# EAGLE design aprs_tracker_v3 (EAGLE 9.6.2)
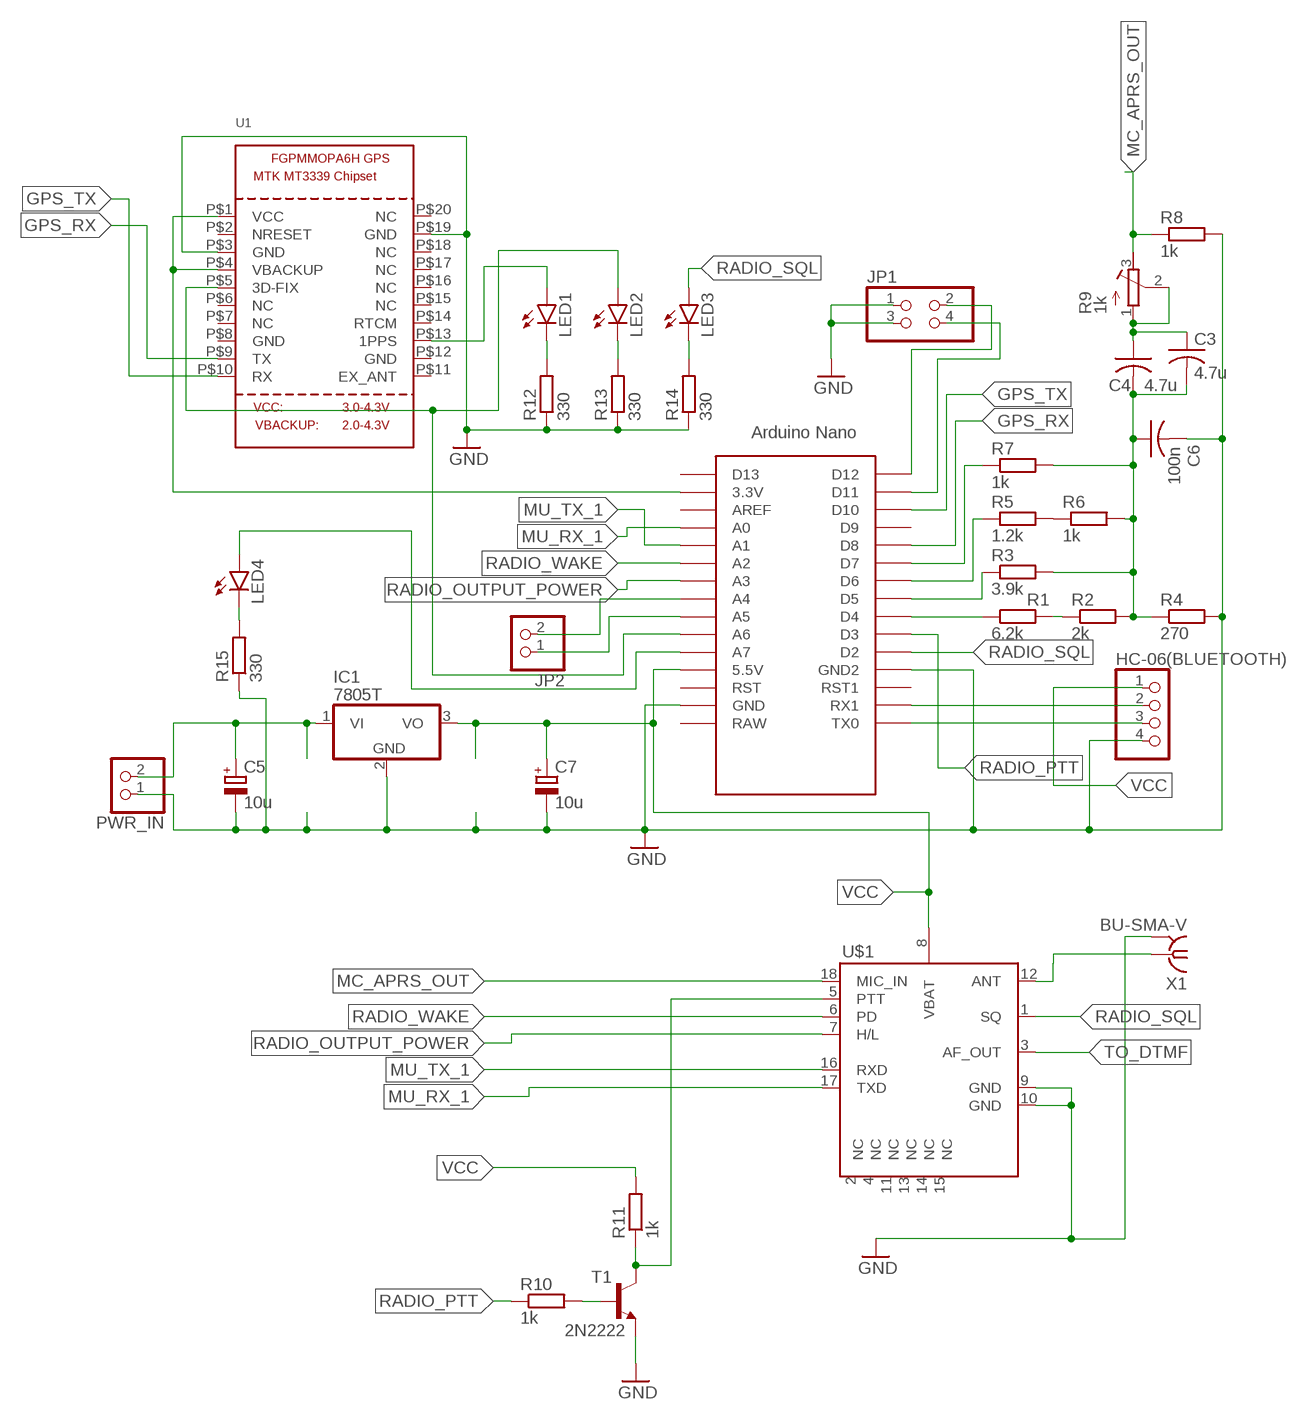
[diagram p0: schematic, sheet 1]

## Parts
C3  4.7u  C-US050-024X044  [C050-024X044]
C4  4.7u  C-USC1206  [C1206]
C5  10u  CPOL-EUE5-6  [E5-6]
C6  100n  C-US050-024X044  [C050-024X044]
C7  10u  CPOL-EUE5-6  [E5-6]
HC-06(BLUETOOTH)  PINHD-1X4  [1X04]
IC1  7805T  [TO220H]
JP1  PINHD-2X2  [2X02]
JP2  PINHD-1X2  [1X02]
LED1  LEDCHIP-LED0805  [CHIP-LED0805]
LED2  LEDCHIP-LED0805  [CHIP-LED0805]
LED3  LEDCHIP-LED0805  [CHIP-LED0805]
LED4  LEDCHIP-LED0805  [CHIP-LED0805]
PWR_IN  PINHD-1X2  [1X02]
R1  6.2k  R-EU_0207/7  [0207/7]
R2  2k  R-EU_0207/7  [0207/7]
R3  3.9k  R-EU_0207/7  [0207/7]
R4  270  R-EU_0204/7  [0204/7]
R5  1.2k  R-EU_0207/7  [0207/7]
R6  1k  R-EU_0207/7  [0207/7]
R7  1k  R-EU_0207/7  [0207/7]
R8  1k  R-EU_0207/7  [0207/7]
R9  1k  R-TRIMM3339P  [RTRIM3339P]
R10  1k  R-EU_0207/7  [0207/7]
R11  1k  R-EU_0207/7  [0207/7]
R12  330  R-EU_R0805  [R0805]
R13  330  R-EU_R0805  [R0805]
R14  330  R-EU_R0805  [R0805]
R15  330  R-EU_R0805  [R0805]
T1  2N2222  [TO92-EBC-OVAL]
U1  GPS_FGPMMOPA6H  [FGPMMOPA6H]
U$1  DRA818A  [DRA818A]
U$4  NANO-2  [NANO-NOICSP]
X1  BU-SMA-V  [BU-SMA-V]

## Nets
GND [V_bat]: C5.- C6.2 C7.- HC-06(BLUETOOTH).4 IC1.2(GND) JP1.1 JP1.3 PWR_IN.1 R4.2 R8.2 R12.1 R13.1 R14.1 R15.1 T1.E U1.P$3(GND) U1.P$19(GND) U$1.9(GND) U$1.10(GND) U$4.GND U$4.GND1(GND2) X1.2 X1.3 X1.4 X1.5
GPS_RX: U1.P$9(TX) U$4.D8
GPS_TX: U1.P$10(RX) U$4.D10
MC_APRS_OUT: R8.1 R9.3(E) U$1.18(MIC_IN)
MU_RX_1: U$1.17(TXD) U$4.A0
MU_TX_1: U$1.16(RXD) U$4.A1
N$1 [50 ohm]: U$1.12(ANT) X1.1
N$2: C5.+ IC1.1(VI) PWR_IN.2
N$3: HC-06(BLUETOOTH).2 U$4.RX1
N$4: R1.1 U$4.D4
N$5: R3.1 U$4.D5
N$6: R5.1 U$4.D6
N$7: R7.1 U$4.D7
N$8: R1.2 R2.1
N$9: R5.2 R6.1
N$10: C3.2 C4.2 C6.1 R2.2 R3.2 R4.1 R6.2 R7.2
N$11: C3.1 C4.1 R9.1(A) R9.2(S)
N$12: R11.1 T1.C U$1.5(PTT)
N$13: HC-06(BLUETOOTH).3 U$4.TX0
N$14: R10.2 T1.B
N$15: JP1.2 U$4.D12
N$16: JP1.4 U$4.D11
N$17: JP2.1 U$4.A5
N$18: JP2.2 U$4.A4
N$19: U1.P$1(VCC) U1.P$4(VBACKUP) U$4.3.3V
N$20: LED1.C R12.2
N$21: LED2.C R13.2
N$22: LED3.C R14.2
N$23: LED1.A U1.P$13(1PPS)
N$24: LED4.C R15.2
N$25: LED4.A U$4.A7
N$26: LED2.A U1.P$5(3D-FIX) U$4.A6
RADIO_OUTPUT_POWER: U$1.7(H/L) U$4.A3
RADIO_PTT: R10.1 U$4.D3
RADIO_SQL: LED3.A U$1.1(SQ) U$4.D2
RADIO_WAKE: U$1.6(PD) U$4.A2
TO_DTMF: U$1.3(AF_OUT)
VCC: C7.+ HC-06(BLUETOOTH).1 IC1.3(VO) R11.2 U$1.8(VBAT) U$4.5V(5.5V)
Unconnected: U1.P$2(NRESET) U1.P$6(NC) U1.P$7(NC) U1.P$8(GND) U1.P$11(EX_ANT) U1.P$12(GND) U1.P$14(RTCM) U1.P$15(NC) U1.P$16(NC) U1.P$17(NC) U1.P$18(NC) U1.P$20(NC) U$1.2(NC) U$1.4(NC) U$1.11(NC) U$1.13(NC) U$1.14(NC) U$1.15(NC) U$4.AREF U$4.D9 U$4.D13 U$4.P$1(ICSP1) U$4.P$2(ICSP2) U$4.P$3(ICSP3) U$4.P$4(ICSP4) U$4.P$5(ICSP5) U$4.P$6(ICSP6) U$4.RAW U$4.RST U$4.RST1

## Library data of the parts
C3 C4 C6 = rcl:C-US: CAPACITOR, American symbol; SPICEPREFIX: C
C5 C7 = rcl:CPOL-EU: POLARIZED CAPACITOR, European symbol; SPICEPREFIX: C
HC-06(BLUETOOTH) = pinhead:PINHD-1X4: PIN HEADER
IC1 = adafruit:78*: Positive VOLTAGE REGULATOR Added bigger pads to the TO-92 package
JP1 = pinhead:PINHD-2X2: PIN HEADER
JP2 PWR_IN = pinhead:PINHD-1X2: PIN HEADER
LED1-LED4 = led:LED: LED OSRAM: - CHIPLED LG R971, LG N971, LY N971, LG Q971, LY Q971, LO R971, LY R971 LH N974, LH R974 LS Q976, LO Q976, LY Q976 LO Q996 - Hyper CHIPLED LW Q18S LB Q993, LB Q99A, LB R99A - SideLED LS A670, LO A670, LY A670, LG A670, LP A670 LB A673, LV A673, LT A673, LW A673 LH A674 LY A675 LS A676, LA A676, LO A676, LY A676, LW A676 LS A679, LY A679, LG A679 - Hyper Micro SIDELED® LS Y876, LA Y876, LO Y876, LY Y876 LT Y87S - SmartLED LW L88C, LW L88S LB L89C, LB L89S, LG L890 LS L89K, LO L89K, LY L89K LS L896, LA L896, LO L896, LY L896 - TOPLED LS T670, LO T670, LY T670, LG T670, LP T670 LSG T670, LSP T670, LSY T670, LOP T670, LYG T670 LG T671, LOG T671, LSG T671 LB T673, LV T673, LT T673, LW T673 LH T674 LS T676, LA T676, LO T676, LY T676, LB T676, LH T676, LSB T676, LW T676 LB T67C, LV T67C, LT T67C, LS T67K, LO T67K, LY T67K, LW E67C LS E67B, LA E67B, LO E67B, LY E67B, LB E67C, LV E67C, LT E67C LW T67C LS T679, LY T679, LG T679 LS T770, LO T770, LY T770, LG T770, LP T770 LB T773, LV T773, LT T773, LW T773 LH T774 LS E675, LA E675, LY E675, LS T675 LS T776, LA T776, LO T776, LY T776, LB T776 LHGB T686 LT T68C, LB T68C - Hyper Mini TOPLED® LB M676 - Mini TOPLED Santana® LG M470 LS M47K, LO M47K, LY M47K Source: http://www.osram.convergy.de LUXEON: - LUMILED® LXK2-PW12-R00, LXK2-PW12-S00, LXK2-PW14-U00, LXK2-PW14-V00 LXK2-PM12-R00, LXK2-PM12-S00, LXK2-PM14-U00 LXK2-PE12-Q00, LXK2-PE12-R00, LXK2-PE12-S00, LXK2-PE14-T00, LXK2-PE14-U00 LXK2-PB12-K00, LXK2-PB12-L00, LXK2-PB12-M00, LXK2-PB14-N00, LXK2-PB14-P00, LXK2-PB14-Q00 LXK2-PR12-L00, LXK2-PR12-M00, LXK2-PR14-Q00, LXK2-PR14-R00 LXK2-PD12-Q00, LXK2-PD12-R00, LXK2-PD12-S00 LXK2-PH12-R00, LXK2-PH12-S00 LXK2-PL12-P00, LXK2-PL12-Q00, LXK2-PL12-R00 Source: www.luxeon.com KINGBRIGHT: KA-3528ASYC Source: www.kingbright.com
R1-R8 R10-R15 = rcl:R-EU_: RESISTOR, European symbol; SPICEPREFIX: R
R9 = rcl:R-TRIMM: Trimm resistor; SPICEMODEL: X; SPICEPREFIXL: POT
T1 = adafruit:2N2222: NPN TRANSISTOR Big oval pads
U1 = adafruit:GPS_FGPMMOPA6H: GPS Module - MTK MT3339 Chipset, -165dBm sensitivity, 22 channels, 10Hz, auto-select external antenna options
U$1 = dorji:DRA818A
U$4 = Arduino-clone:NANO-2
X1 = con-coax:BU-SMA-V: FEMALE SMA CONNECTOR Radiall distributor RS 112-3794; OC_FARNELL: unknown; OC_NEWARK: unknown

## Net classes
0 default: width 0.356 mm, clearance 0.381 mm
1 PWR: width 0.254 mm, clearance 0.305 mm
2 V_bat: width 0.305 mm, clearance 0.152 mm
3 50 ohm: width 1.21 mm, clearance 0.26 mm

## Board
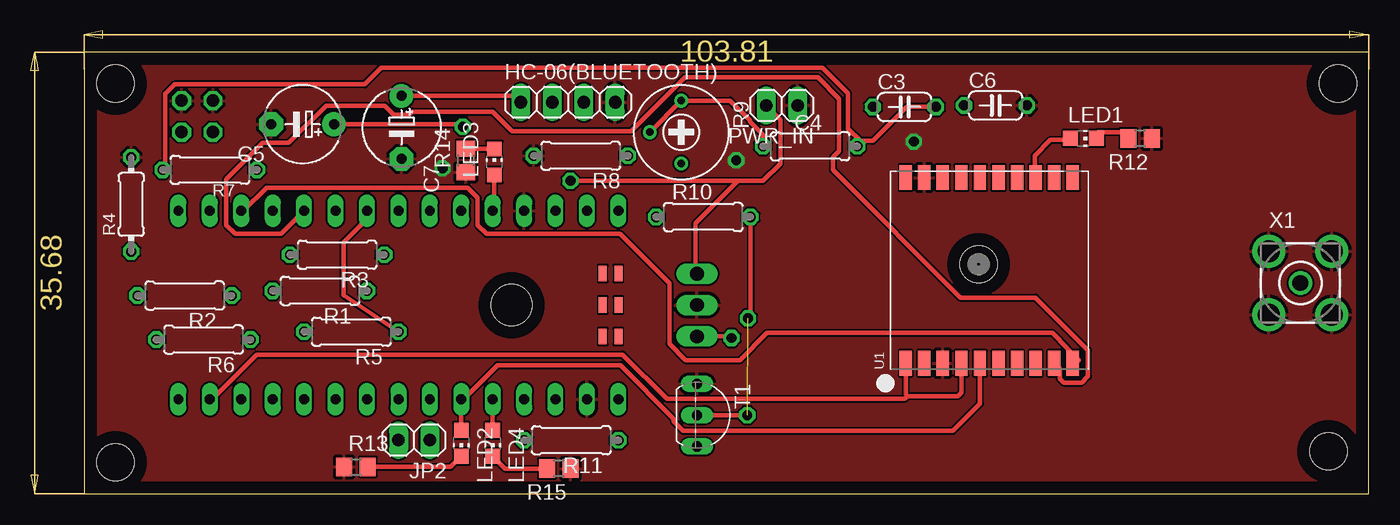
[diagram p1: board, top side]
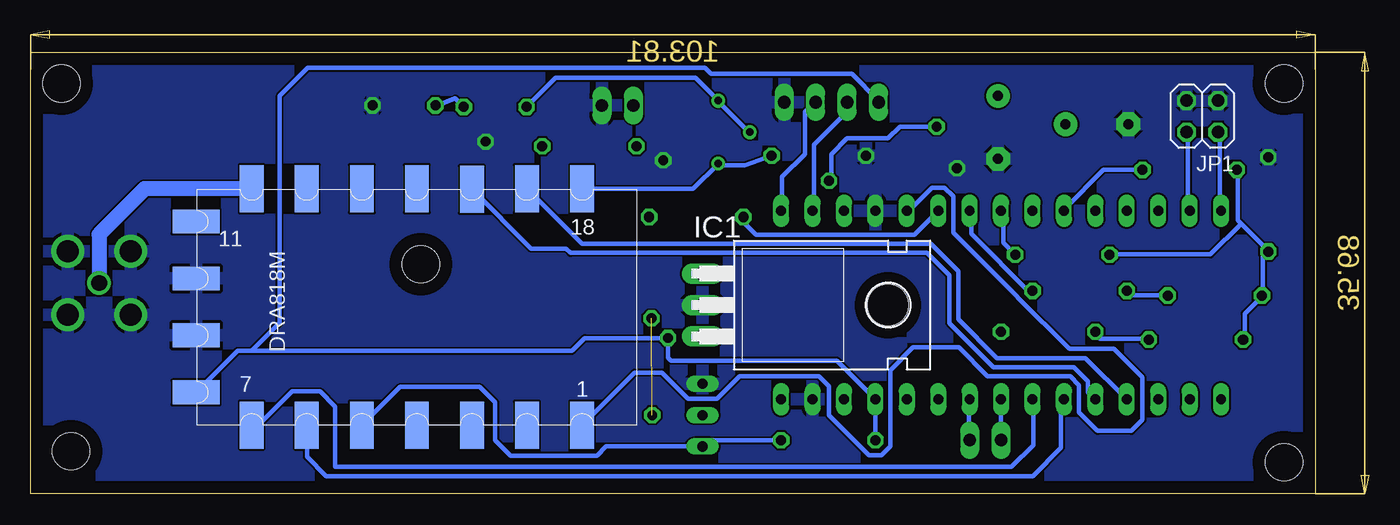
[diagram p2: board, bottom side, seen from below]

Size 103.81 x 35.68 mm. Coordinates in mm from the lower left corner, seen from the top.
Outline: 0,0 103.81,0 103.81,35.68 0,35.68 0,0
Copper layers (1*16): Top 0.035mm / dielectric 1.5mm / Bottom 0.035mm
Design rules "default": minimum track width 6mil, minimum drill 0.35mm, track to track 6mil, track to pad 6mil, pad to pad 6mil, via to via 6mil, smd to smd 6mil, copper to edge 40mil, drill to drill 6mil, minimum pad ring 10mil, minimum via ring 8mil, stop-mask expansion 4mil, vias tented up to drill 0mil, thermal gap 10mil
Holes 3 mm at 2.54,33.15 2.54,2.54 101.35,33.15 100.58,3.43

### Footprints (pad centres in the part's own frame; a part is rotated, then mirrored left to right if it is on the bottom)
C050-024X044 = drill 0.813 octagon: 1 -2.54,0; 2 2.54,0
0207/7 = drill 0.813 octagon: 1 -3.81,0; 2 3.81,0
E5-6 = drill 0.813 pad 1.905: + -2.54,0 | drill 0.813 pad 1.905 octagon: - 2.54,0
1X04 = drill 1.016 long: 1 -3.81,0; 2 -1.27,0; 3 1.27,0; 4 3.81,0
TO220H = drill 1.118 long: 1 -2.54,-10.16; 2 0,-10.16; 3 2.54,-10.16 | hole 3.302: 0,4.826
2X02 = drill 1.016 octagon: 1 -1.27,-1.27; 2 -1.27,1.27; 3 1.27,-1.27; 4 1.27,1.27
1X02 = drill 1.016 long: 1 -1.27,0; 2 1.27,0
CHIP-LED0805 = smd 1.2 x 1.2: A 0,-1.05; C 0,1.05
0204/7 = drill 0.813 octagon: 1 -3.81,0; 2 3.81,0
RTRIM3339P = drill 0.61: 1 -2.54,0; 2 0,-2.54; 3 2.54,0
R0805 = smd 1.3 x 1.5: 1 -0.95,0; 2 0.95,0
TO92-EBC-OVAL = drill 0.813 long: B 0,-1.27; C 2.54,-1.27; E -2.54,-1.27
FGPMMOPA6H = smd 2 x 1: P$1 -7.5,6.75; P$2 -7.5,5.25; P$3 -7.5,3.75; P$4 -7.5,2.25; P$5 -7.5,0.75; P$6 -7.5,-0.75; P$7 -7.5,-2.25; P$8 -7.5,-3.75; P$9 -7.5,-5.25; P$10 -7.5,-6.75; P$11 7.5,-6.75; P$12 7.5,-5.25; P$13 7.5,-3.75; P$14 7.5,-2.25; P$15 7.5,-0.75; P$16 7.5,0.75; P$17 7.5,2.25; P$18 7.5,3.75; P$19 7.5,5.25; P$20 7.5,6.75 | hole 3: 0.5,0.85
DRA818A = smd 3.81 x 1.93: 1 -9.45,-13.25; 2 -9.45,-8.8; 3 -9.45,-4.35; 4 -9.45,0.1; 5 -9.45,4.55; 6 -9.45,9; 7 -9.45,13.45; 12 9.65,13.45; 13 9.65,9; 14 9.65,4.55; 15 9.65,0.1; 16 9.6,-4.35; 17 9.65,-8.8; 18 9.65,-13.25 | smd 1.93 x 3.81: 8 -6.8,17.95; 9 -2.2,17.95; 10 2.4,17.95; 11 7,17.95
NANO-NOICSP = drill 0.8 long: 3.3V -10.16,24.13; 5V -10.16,-1.27; A0 -10.16,19.05; A1 -10.16,16.51; A2 -10.16,13.97; A3 -10.16,11.43; A4 -10.16,8.89; A5 -10.16,6.35; A6 -10.16,3.81; A7 -10.16,1.27; AREF -10.16,21.59; D2 5.08,1.27; D3 5.08,3.81; D4 5.08,6.35; D5 5.08,8.89; D6 5.08,11.43; D7 5.08,13.97; D8 5.08,16.51; D9 5.08,19.05; D10 5.08,21.59; D11 5.08,24.13; D12 5.08,26.67; D13 -10.16,26.67; GND -10.16,-6.35; GND1 5.08,-1.27; RAW -10.16,-8.89; RST -10.16,-3.81; RST1 5.08,-3.81; RX1 5.08,-6.35; TX0 5.08,-8.89 | smd 1.27 x 0.635: P$1 -5.08,-8.89; P$2 -5.08,-7.62; P$3 -2.54,-7.62; P$4 0,-7.62; P$5 -2.54,-8.89; P$6 0,-8.89
BU-SMA-V = drill 1.27: 1 0,0 | drill 1.778: 2 -2.55,2.55; 3 2.55,2.55; 4 2.55,-2.55; 5 -2.55,-2.55

### Placement (x,y rotation side)
C3  66.29,31.24 0 top
C4  4.7u  [0207/7]  58.67,28.07 0 top
C5  [E5-6]  17.65,29.84 180 top
C6  73.66,31.37 0 top
C7  [E5-6]  25.65,29.59 270 top
HC-06(BLUETOOTH)  39.12,31.62 0 top
IC1  39.37,15.24 270 bottom
JP1  9.14,30.48 180 bottom
JP2  26.67,4.32 180 top
LED1  80.77,28.7 270 top
LED2  30.48,4.06 180 top
LED3  33.15,26.8 0 top
LED4  33.02,4.06 180 top
PWR_IN  56.39,31.37 180 top
R1  19.05,16.38 180 top
R2  8.13,16 180 top
R3  20.45,19.3 180 top
R4  3.81,23.37 90 top
R5  21.59,13.08 180 top
R6  9.65,12.45 180 top
R7  10.16,26.16 180 top
R8  40.13,27.3 180 top
R9  48.26,29.21 270 top
R10  50.04,22.35 0 top
R11  39.37,4.32 180 top
R12  85.34,28.7 180 top
R13  21.97,2.16 0 top
R14  30.86,26.92 90 top
R15  38.35,2.03 180 top
T1  50.8,6.35 270 top
U1  73.15,18.03 90 top
U$1  72.52,14.99 90 bottom
U$4  34.29,17.78 90 top
X1  98.3,17.02 0 top

### Tracks (layer width: path | path; a pad name or v marks a point on that pad's centre or on a via)
GND  (via drill 0.8 pad 1.3)
  other vias: 28.96,26.29 67.06,28.45 52.7,26.92
  pour Top: -1.78,35.05 -1.78,-1.27 106.17,-1.27 106.17,35.05
  pour Bottom: -5.08,38.35 105.16,38.35 105.16,-1.27 -5.08,-1.27
GPS_RX
  Top 0.356: U1.P$9 78.84,10.09 78.84,9.3 79.17,8.97 80.63,8.97 81.13,9.47 81.13,11.6 76.89,15.84 70.83,15.84 60.5,26.16 60.5,27.18 61.01,27.68 61.01,31.92 59.3,33.63 48.56,33.63 44.22,29.29 34.59,29.29 34.1,29.78 33.02,30.86 26.52,30.86 26.28,30.62 25.03,30.62 24.29,31.36 19.57,31.36 16.54,28.33 14.42,28.33 11.49,25.4 11.49,21.7 12.2,20.99 15.91,20.99 U$4.D8
GPS_TX
  Top 0.356: U$4.D10 12.87,22.86 14.74,24.73 30.98,24.73 31.81,23.9 31.81,21.7 32.52,20.99 43.32,20.99 47.3,17.02 47.3,12.12 48.62,10.79 53.02,10.79 55.2,12.98 78.24,12.98 79.46,11.77 79.46,11.72 80.39,10.79 79.69,10.1 79.69,10.32 U1.P$10
MC_APRS_OUT
  Bottom 0.356: U$1.18 50.29,24.64 R9.3 48.25,26.52 46.11,26.52 R8.1
MU_RX_1
  Bottom 0.356: U$1.17 59.27,20.19 31.75,20.19 31.09,20.19 28.85,17.96 28.85,14.09 25.73,10.96 18.58,10.96 U$4.A0
MU_TX_1
  Bottom 0.356: U$1.16 63.38,19.8 60.56,19.8 60.21,19.46 31.39,19.46 29.59,17.65 29.59,13.78 26.04,10.22 19.51,10.22 18.37,9.08 18.37,8.21 U$4.A1
N$1
  Bottom 1.21: U$1.12 94.62,24.64 98.3,20.95 X1.1
N$2  (via drill 0.8 pad 1.3)
  Top 0.356: IC1.1 49.4,17.91 49.4,21.84 52.83,25.27 | 52.83,25.27 54.86,25.27 56.26,26.67 56.26,30.23 PWR_IN.2 | C5.+ 30.61,29.84 v30.61,29.65 | v39.3,25.27 52.83,25.27
  Bottom 0.356: v30.61,29.65 33.59,29.65 34.54,28.7 37.85,28.7 39.12,27.43 39.12,25.27 v39.3,25.27
N$3
  Bottom 0.356: U$4.RX1 40.51,23.02 40.51,28.19 37.85,30.86 HC-06(BLUETOOTH).2
N$4
  Bottom 0.356: U$4.D4 27.81,22.84 27.81,20.99 23.02,16.2 R1.1
N$5
  Bottom 0.356: U$4.D5 25.23,22.84 25.23,20.26 24.31,19.34 R3.1
N$6
  Top 0.356: U$4.D6 22.86,22.23 20.95,20.32 20.95,16.04 R5.1
N$7
  Bottom 0.356: U$4.D7 20.26,23.02 17.13,26.15 13.99,26.15 R7.1
N$8
  Bottom 0.356: R2.1 11.97,16.02 14.92,16.02 15.1,16.2 R1.2
N$9
  Bottom 0.356: R6.1 13.63,12.52 17.41,12.52 R5.2
N$10
  Top 0.356: 62.74,28.5 63.75,28.5 66.49,31.24 C3.2 | R7.2 6.55,26.36 6.55,32.3 7.33,33.07 22.68,33.07 24.01,34.4 59.69,34.4 61.75,32.35 61.75,29.49 62.74,28.5 | C4.2 62.74,28.32 62.74,28.5
  Bottom 0.356: C3.2 69.53,31.94 71.12,31.31 C6.1 | R6.2 5.71,12.52 5.71,14.55 4.42,15.84 R2.2 4.24,16.02 4.24,19.15 3.87,19.52 R4.1 3.87,19.7 5.99,21.82 | 5.99,21.82 6.26,22.1 6.26,26.15 R7.2 | 5.99,21.82 8.47,19.34 16.57,19.34 R3.2
N$11
  Top 0.356: R9.2 R9.1 52.2,31.75 53.8,30.15 53.8,30.06 54.86,28.99 C4.1
  Bottom 0.356: R9.2 45.85,29.28 48.25,31.67 R9.1 50.1,33.59 61.4,33.59 C3.1
N$12
  Bottom 0.356: R11.1 49.02,4.32 T1.C 57.33,3.81 58.07,3.07 65.05,3.07 66.29,4.32 66.29,7.37 67.56,8.64 73.97,8.64 U$1.5
N$13
  Bottom 0.356: HC-06(BLUETOOTH).3 40.48,31.62 41.25,30.85 41.25,27.44 43.09,25.6 43.09,23.02 U$4.TX0
N$14  (via drill 0.8 pad 1.3)  (1 unrouted)
  Top 0.356: R10.2 53.85,14.16 v53.66,14.16 | T1.B v53.59,6.35
N$15
  Bottom 0.356: U$4.D12 7.73,23.02 7.73,29.1 JP1.2
N$16
  Bottom 0.356: U$4.D11 10.31,23.02 10.31,29.1 JP1.4
N$17
  Bottom 0.356: U$4.A5 27.99,7.55 27.99,4.42 JP2.1
N$18
  Bottom 0.356: U$4.A4 25.41,7.55 25.41,4.42 JP2.2
N$19
  Top 0.356: U1.P$4 70.9,8.16 70.61,7.87 66.55,7.87 | U1.P$1 66.4,8.02 66.55,7.87 | U$4.3.3V 10.33,7.62 13.95,11.24 43.52,11.24 47.09,7.67 66.34,7.67 66.55,7.87
N$20
  Top 0.356: LED1.C 81.92,29.21 83.82,29.21 R12.2
N$21
  Top 0.356: R13.2 29.62,2.16 LED2.C
N$22
  Top 0.356: R14.2 33.12,27.87 LED3.C
N$23
  Top 0.356: LED1.A 79.38,28.57 78.11,28.57 76.83,27.3 76.83,26.04 U1.P$13
N$24
  Top 0.356: LED4.C 34,2.03 R15.2
N$25
  Top 0.356: U$4.A7 LED4.A
N$26
  Top 0.356: LED2.A U$4.A6 30.65,7.62 33.41,10.38 43.34,10.38 47.65,6.07 47.65,5.84 48.41,5.08 70.23,5.08 72.4,7.25 U1.P$5
RADIO_OUTPUT_POWER
  Bottom 0.356: U$4.A3 22.69,7.62 22.81,7.5 22.81,3.9 24.55,2.16 79.23,2.16 79.23,7.03 80.45,8.25 82.71,8.25 85.43,5.54 U$1.7
RADIO_PTT
  Bottom 0.356: U$4.D3 32.41,20.93 45.21,20.93 46.23,21.95 R10.1
RADIO_SQL
  Top 0.356: LED3.A 33.15,22.99 U$4.D2
  Bottom 0.356: U$4.D2 32.85,22.86 30.98,24.73 29.98,24.73 29.27,24.02 29.27,21.08 24.08,15.89 24.08,15.88 19.9,11.7 19.68,11.7 16.27,11.7 13.97,9.4 13.97,5.97 14.86,5.08 17.61,5.08 19.11,6.58 19.11,8.78 19.82,9.49 26.5,9.49 28.83,11.81 32.51,11.81 34.34,9.98 34.34,3.81 35.05,3.1 36.06,3.1 39.31,6.35 39.31,8.66 40.14,9.49 46.55,9.49 48.37,7.67 50.7,7.67 52.8,9.78 55.02,9.78 U$1.1
RADIO_WAKE
  Bottom 0.356: U$4.A2 20.55,7.39 20.55,3.72 22.85,1.42 79.93,1.42 81.49,2.98 81.49,4.78 81.52,4.81 U$1.6
VCC  (via drill 0.8 pad 1.3)
  Top 0.356: v52.32,12.57 52.2,12.7 IC1.3 | C7.+ 34.8,32.13 HC-06(BLUETOOTH).1
  Bottom 0.356: R11.2 U$4.5V 38.68,10.74 52.09,10.74 52.32,10.97 v52.32,12.57 59.05,12.57 60.1,11.53 85.98,11.53 | U$1.8 87.12,11.53 85.98,11.53 | 85.98,11.53 83.69,13.82 83.69,32.13 81.43,34.39 49.32,34.39 48.84,33.91 37.47,33.91 35.31,31.75 HC-06(BLUETOOTH).1